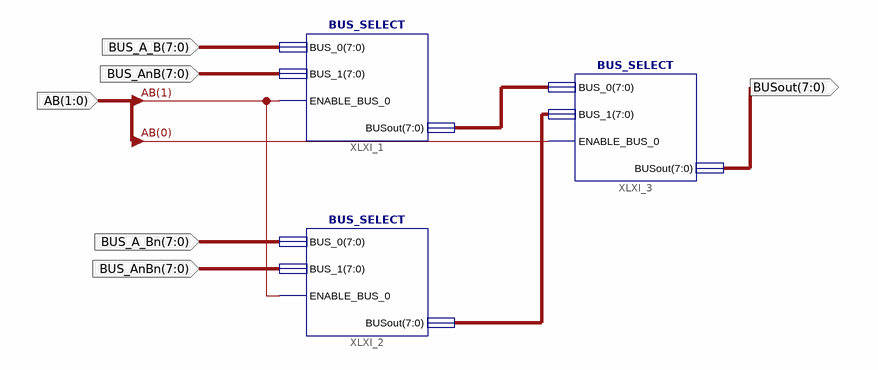
[diagram p0: schematic sheet 1]
// Xilinx ISE schematic BUS4_SELECT.sch (spartan3) as structural Verilog: 3 symbols, 6 ports
module BUS4_SELECT (
  input  [7:0] BUS_A_B,
  input  [7:0] BUS_AnB,
  input  [7:0] BUS_A_Bn,
  input  [7:0] BUS_AnBn,
  input  [1:0] AB,
  output [7:0] BUSout
);

  wire [7:0] XLXN_1, XLXN_2;

  BUS_SELECT XLXI_1 (.BUS_0(BUS_A_B), .BUS_1(BUS_AnB), .ENABLE_BUS_0(AB[1]), .BUSout(XLXN_1));
  BUS_SELECT XLXI_3 (.BUS_0(XLXN_1), .BUS_1(XLXN_2), .ENABLE_BUS_0(AB[0]), .BUSout(BUSout));
  BUS_SELECT XLXI_2 (.BUS_0(BUS_A_Bn), .BUS_1(BUS_AnBn), .ENABLE_BUS_0(AB[1]), .BUSout(XLXN_2));
endmodule
